# Altium project RaumluftsensorC3.PrjPcb
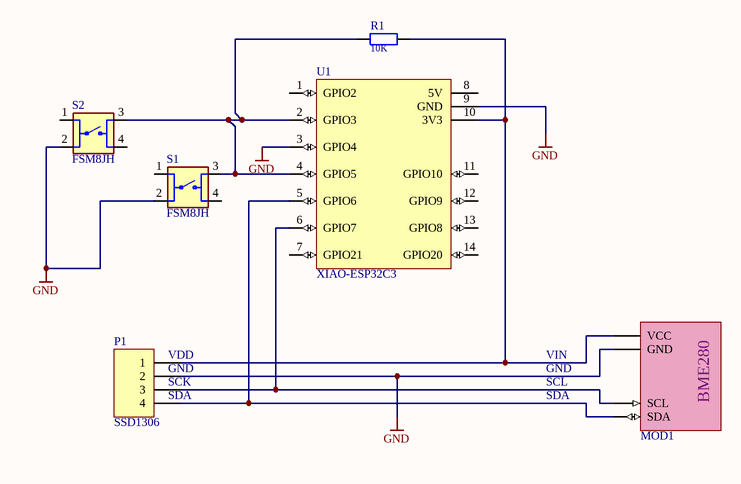
[diagram p0: RaumluftsensorC3.SchDoc]
1 sheet, 6 parts. Net scope: global (net labels, ports and power ports of the same name join across sheets).
Board file: RaumluftsensorC3.PcbDoc

## Sheet RaumluftsensorC3.SchDoc
size A4; DocumentNumber: 1; Revision: 0.1; SheetNumber: 1; SheetTotal: 1; HTL_Gruppe: I; HTL_Klasse: Klasse; HTL_Zusaetzlicher_Titel: zusätzlicher Titel; HTL_Schueler_Name: Max Mustermann; PageSetup: Record=PageOptions|CenterHorizontal=True|CenterVertical=True|PrintScale=1.00|XCorrection=1.00|YCorrection=1.00|PrintKind=0|BorderSize=5000000|LeftOffset=0|BottomOffset=0|Orientation=2|PaperLength=1000|PaperWidth=1000|Scale=100|PaperSource=7|PrintQuality=-4|MediaType=1|DitherType=10|PaperKind=A4|PrintScaleMode=1; HTL_Projektname: Projektname; HTL_Dokumentenart: Dokumentenart; HTL_Dokumentenstatus: Dokumentenstatus; SPICEModelCacheJVCKNDJX: <root> / <DocumentId>JVCKNDJX</DocumentId> / </root>

### Parts
MOD1  BME280  [BME280]  (value not drawn)
P1  SSD1306  [HDR1X4]
R1  10K  [R_0207/RM4]
S1  FSM8JH  [SW_FSM8JH]
S2  FSM8JH  [SW_FSM8JH]
U1  XIAO-ESP32C3  [PCBComponent_1]

### Nets
GND: MOD1.2(GND) P1.2 S1.2 S2.2 U1.3(GPIO4) U1.9(GND)
NetMOD1_1: MOD1.1(VCC) P1.1 R1.1 U1.10(3V3)
NetMOD1_3: MOD1.3(SCL) P1.3 U1.6(GPIO7)
NetMOD1_4: MOD1.4(SDA) P1.4 U1.5(GPIO6)
NetR1_2: R1.2 S1.3 S2.3 U1.2(GPIO3) U1.4(GPIO5)

Not connected (* = marked no-connect by the designer): S1 1 4; S2 1 4; U1 1(GPIO2) 7(GPIO21) 8(5V) 11(GPIO10) 12(GPIO9) 13(GPIO8) 14(GPIO20)

### Notes on the sheet
- (near P1) VDD
- (near P1) GND
- (near P1) SCK
- GND
- VIN
- SCL
- (near P1) SDA
- SDA
- Sachnummer / Dateiname:
- Name:
- Gruppe:
- Klasse:
- Elektronik &
- Technische Informatik
- Anichstraße 26 - 28
- HTBLVA
- Titel:
- Datum:
- Dokumentenart:
- Dokumentenstatus:
- A - 6020 Innsbruck
- Ver.:
- Blatt:
- Blätter:

### Library data of the parts
MOD1 = BME280: Bosch BME280 Module GY-BME280-3.3; Usage: only permitted for non-commercial purposes at HTL I Innsbruck; Published: 06-Jan-2018; Publisher: Michael Kupfner; LatestRevisionDate: 06-Jan-2018
P1 = Header 4: OLED SSD1306 - Display; LatestRevisionDate: 17-Jul-2002; LatestRevisionNote: Re-released for DXP Platform.; Publisher: Altium Limited
R1 = R: Resistor; Usage: only permitted for non-commercial purposes at HTL I Innsbruck; Published: 21-Feb-2011; LatestRevisionDate: 07-Sep-2019; Value: 10K
S1 S2 = FSM8JH: Tactile Switch SPST-NO Top Actuated Through Hole; MF: TE Connectivity; Check_prices: https://www.snapeda.com/parts/FSM8JH/TE+Connectivity+ALCOSWITCH+Switches/view-part/?ref=eda; Value: *; Availability: In Stock; MP: FSM8JH; Price: None; Package: None; SnapEDA_Link: https://www.snapeda.com/parts/FSM8JH/TE+Connectivity+ALCOSWITCH+Switches/view-part/?ref=snap